# EasyEDA Pro project SMPS_V1.epro, schematic Schematic10
Board Name: Active Rectifier; Create Date: 2026-03-06; Page Name: P1; Project Name: TL494-PSU-V1; Schematic Name: Schematic10; Update Date: 2026-03-06; Company: EasyEDA.com; Page Size: A4; Version: V1.0
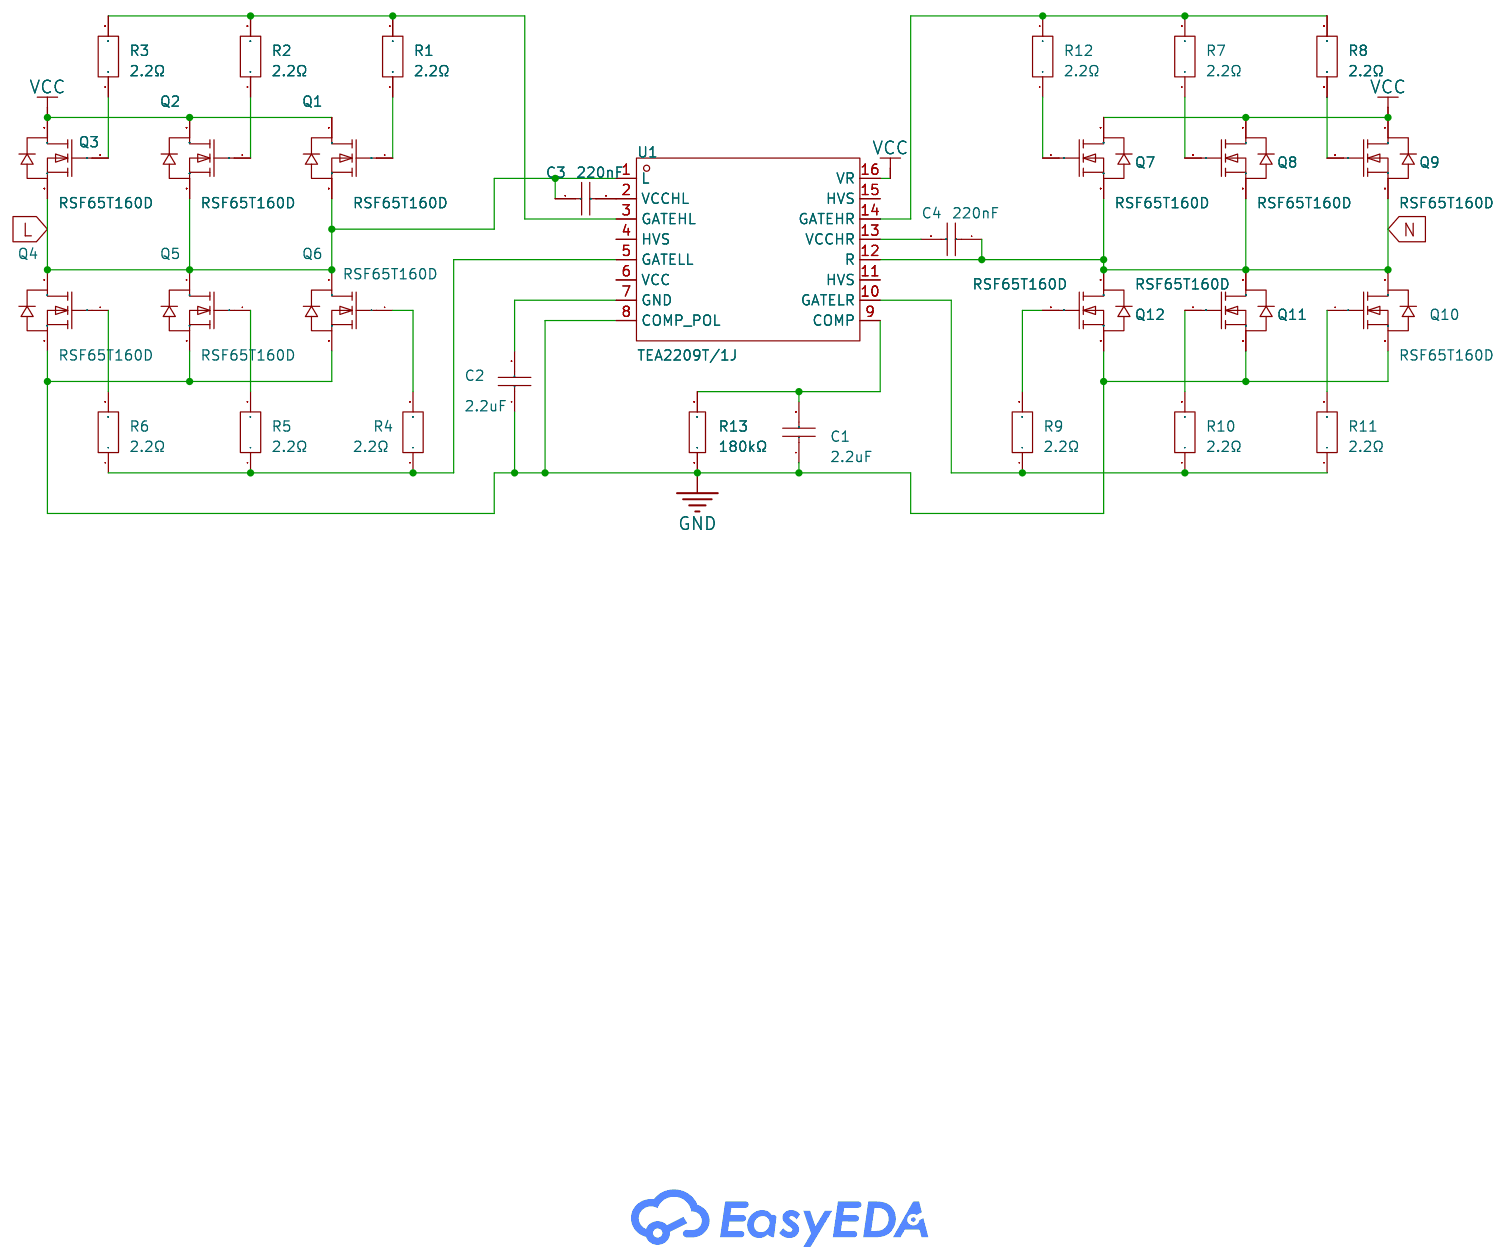
[diagram p2: schematic sheet]

## Parts
C1  2.2uF  [C1206]
C2  2.2uF  [C1206]
C3  220nF  [C0603]
C4  220nF  [C0603]
Q1  RSF65T160D  [TO-252-2_L6.6-W6.1-P4.57-LS9.9-BR-CW]
Q2  RSF65T160D  [TO-252-2_L6.6-W6.1-P4.57-LS9.9-BR-CW]
Q3  RSF65T160D  [TO-252-2_L6.6-W6.1-P4.57-LS9.9-BR-CW]
Q4  RSF65T160D  [TO-252-2_L6.6-W6.1-P4.57-LS9.9-BR-CW]
Q5  RSF65T160D  [TO-252-2_L6.6-W6.1-P4.57-LS9.9-BR-CW]
Q6  RSF65T160D  [TO-252-2_L6.6-W6.1-P4.57-LS9.9-BR-CW]
Q7  RSF65T160D  [TO-252-2_L6.6-W6.1-P4.57-LS9.9-BR-CW]
Q8  RSF65T160D  [TO-252-2_L6.6-W6.1-P4.57-LS9.9-BR-CW]
Q9  RSF65T160D  [TO-252-2_L6.6-W6.1-P4.57-LS9.9-BR-CW]
Q10  RSF65T160D  [TO-252-2_L6.6-W6.1-P4.57-LS9.9-BR-CW]
Q11  RSF65T160D  [TO-252-2_L6.6-W6.1-P4.57-LS9.9-BR-CW]
Q12  RSF65T160D  [TO-252-2_L6.6-W6.1-P4.57-LS9.9-BR-CW]
R1  2.2Ω  [R1206]
R2  2.2Ω  [R1206]
R3  2.2Ω  [R1206]
R4  2.2Ω  [R1206]
R5  2.2Ω  [R1206]
R6  2.2Ω  [R1206]
R7  2.2Ω  [R1206]
R8  2.2Ω  [R1206]
R9  2.2Ω  [R1206]
R10  2.2Ω  [R1206]
R11  2.2Ω  [R1206]
R12  2.2Ω  [R1206]
R13  180kΩ  [R1206]
U1  TEA2209T/1J  [SOIC-16_L9.9-W3.9-P1.27-LS6.0-BL]

## Library data of the parts
C1 C2 = CL31B225KBHNNNE: Capacitance:2.2uF Tolerance:±10% Tolerance:±10% Voltage Rating:50V Temperature Coefficient:X7R; LCSC Part Name: 2.2uF ±10% 50V; Supplier Part: C50254; Manufacturer: SAMSUNG(三星); Supplier Footprint: 1206; JLCPCB Part Class: Basic Part; Datasheet: https://item.szlcsc.com/datasheet/CL31B225KBHNNNE/51263.html; Supplier: LCSC; Tolerance: ±10%; Voltage Rating: 50V; Temperature Coefficient: X7R
C3 C4 = CL10B224KB8NNNC: Capacitance:220nF Tolerance:±10% Tolerance:±10% Voltage Rating:50V Temperature Coefficient:X7R; LCSC Part Name: 220nF ±10% 50V; Supplier Part: C64705; Manufacturer: SAMSUNG(三星); Supplier Footprint: 0603; JLCPCB Part Class: Extended Part; Datasheet: https://item.szlcsc.com/datasheet/CL10B224KB8NNNC/65773.html; Supplier: LCSC; Tolerance: ±10%; Voltage Rating: 50V; Temperature Coefficient: X7R
Q1-Q12 = RSF65T160D: Drain to Source Voltage:650V Current - Continuous Drain(Id):22A RDS(on):130mΩ@10V,10A Pd - Power Dissipation:119W Gate Threshold Voltage (Vgs(th)):4.5V@250uA Gate Charge(Qg):33.8nC@10V Input Capacitance(Ciss):1.656nF@200V Reverse Transfer Capacitance (Crs; Supplier Part: C51904721; Manufacturer: REASUNOS(瑞森半导体); Supplier Footprint: TO-252; JLCPCB Part Class: Extended Part; Datasheet: https://item.szlcsc.com/datasheet/RSF65T160D/54597853.html; Supplier: LCSC; Drain to Source Voltage: 650V; Current - Continuous Drain(Id): 22A; RDS(on): 130mΩ@10V,10A; Pd - Power Dissipation: 119W; Gate Threshold Voltage (Vgs(th)): 4.5V@250uA; Gate Charge(Qg): 33.8nC@10V; Input Capacitance(Ciss): 1.656nF@200V; Reverse Transfer Capacitance (Crss@Vds): 2.8pF@200V; Operating Temperature: -55℃~+150℃@(Tj); Output Capacitance(Coss): 52pF
R1-R12 = FRC1206F2R20TS: Type:Thick Film Resistor Resistance:2.2Ω Tolerance:±1% Tolerance:±1% Power(Watts):250mW Voltage-Supply(Max):200V Temperature Coefficient:±200ppm/℃ Temperature Coefficient:±200ppm/℃ Operating Temperature:-55℃~+155℃ Operating Temperature:-55℃~+155℃; LCSC Part Name: 2.2Ω ±1% 250mW 厚膜电阻; Supplier Part: C2907376; Manufacturer: FOJAN(富捷); Supplier Footprint: 1206; JLCPCB Part Class: Extended Part; Supplier: LCSC; Type: Thick Film Resistor; Tolerance: ±1%; Power(Watts): 250mW; Voltage-Supply(Max): 200V; Temperature Coefficient: ±200ppm/℃; Operating Temperature: -55℃~+155℃
R13 = RC1206FR-07180KL: Type:Thick Film Resistor Resistance:180kΩ Tolerance:±1% Tolerance:±1% Power(Watts):250mW Voltage-Supply(Max):200V Temperature Coefficient:±100ppm/℃ Temperature Coefficient:±100ppm/℃ Operating Temperature:-55℃~+155℃ Operating Temperature:-55℃~+155℃; LCSC Part Name: 厚膜电阻 180kΩ ±1% 250mW; Supplier Part: C137381; Manufacturer: YAGEO(国巨); Supplier Footprint: 1206; JLCPCB Part Class: Extended Part; Datasheet: https://item.szlcsc.com/datasheet/RC1206FR-07180KL/148697.html; Supplier: LCSC; Type: Thick Film Resistor; Tolerance: ±1%; Power(Watts): 250mW; Voltage-Supply(Max): 200V; Temperature Coefficient: ±100ppm/℃; Operating Temperature: -55℃~+155℃
U1 = TEA2209T/1J: Supplier Part: C3192295; Manufacturer: NXP(恩智浦); Supplier Footprint: SO-16; JLCPCB Part Class: Extended Part; Datasheet: https://www.nxp.com.cn/docs/zh/data-sheet/TEA2209T.pdf; Supplier: LCSC

## Nets
GND: C1.1 C2.1 Q4.3(S) Q5.3(S) Q6.3(S) Q10.3(S) Q11.3(S) Q12.3(S) R13.1 U1.8(COMP_POL)
VCC: Q1.2(D) Q2.2(D) Q3.2(D) Q7.2(D) Q8.2(D) Q9.2(D) U1.16(VR)
L: C3.1 Q1.3(S) Q2.3(S) Q3.3(S) Q4.2(D) Q5.2(D) Q6.2(D) U1.1(L)
N: C4.1 Q7.3(S) Q8.3(S) Q9.3(S) Q10.2(D) Q11.2(D) Q12.2(D) U1.12(R)
$1N945: Q1.1(G) R1.1
$1N994: Q2.1(G) R2.1
$1N1081: Q6.1(G) R4.2
$1N1130: Q5.1(G) R5.2
$1N1179: Q4.1(G) R6.2
$1N1235: Q3.1(G) R3.1
$1N1435: Q11.1(G) R10.2
$1N1437: Q10.1(G) R11.2
$1N1451: Q7.1(G) R12.1
$1N1453: Q8.1(G) R7.1
$1N1458: Q9.1(G) R8.1
$1N1549: Q12.1(G) R9.2
$1N1865: C1.2 R13.2 U1.9(COMP)
$1N1914: C3.2 U1.2(VCCHL)
$1N1950: C4.2 U1.13(VCCHR)
$1N2116: R1.2 R2.2 R3.2 U1.3(GATEHL)
$1N2181: R4.1 R5.1 R6.1 U1.5(GATELL)
$1N2185: R9.1 R10.1 R11.1 U1.10(GATELR)
$1N2283: R7.2 R8.2 R12.2 U1.14(GATEHR)
$1N2359: C2.2 U1.7(GND)

Not connected (* = marked no-connect by the designer): U1 4(HVS) 6(VCC) 11(HVS) 15(HVS)
